# Altium schematic sheet BLOCK-DIAGRAM.SchDoc
size A4; SheetNumber: 2; SheetTotal: 7
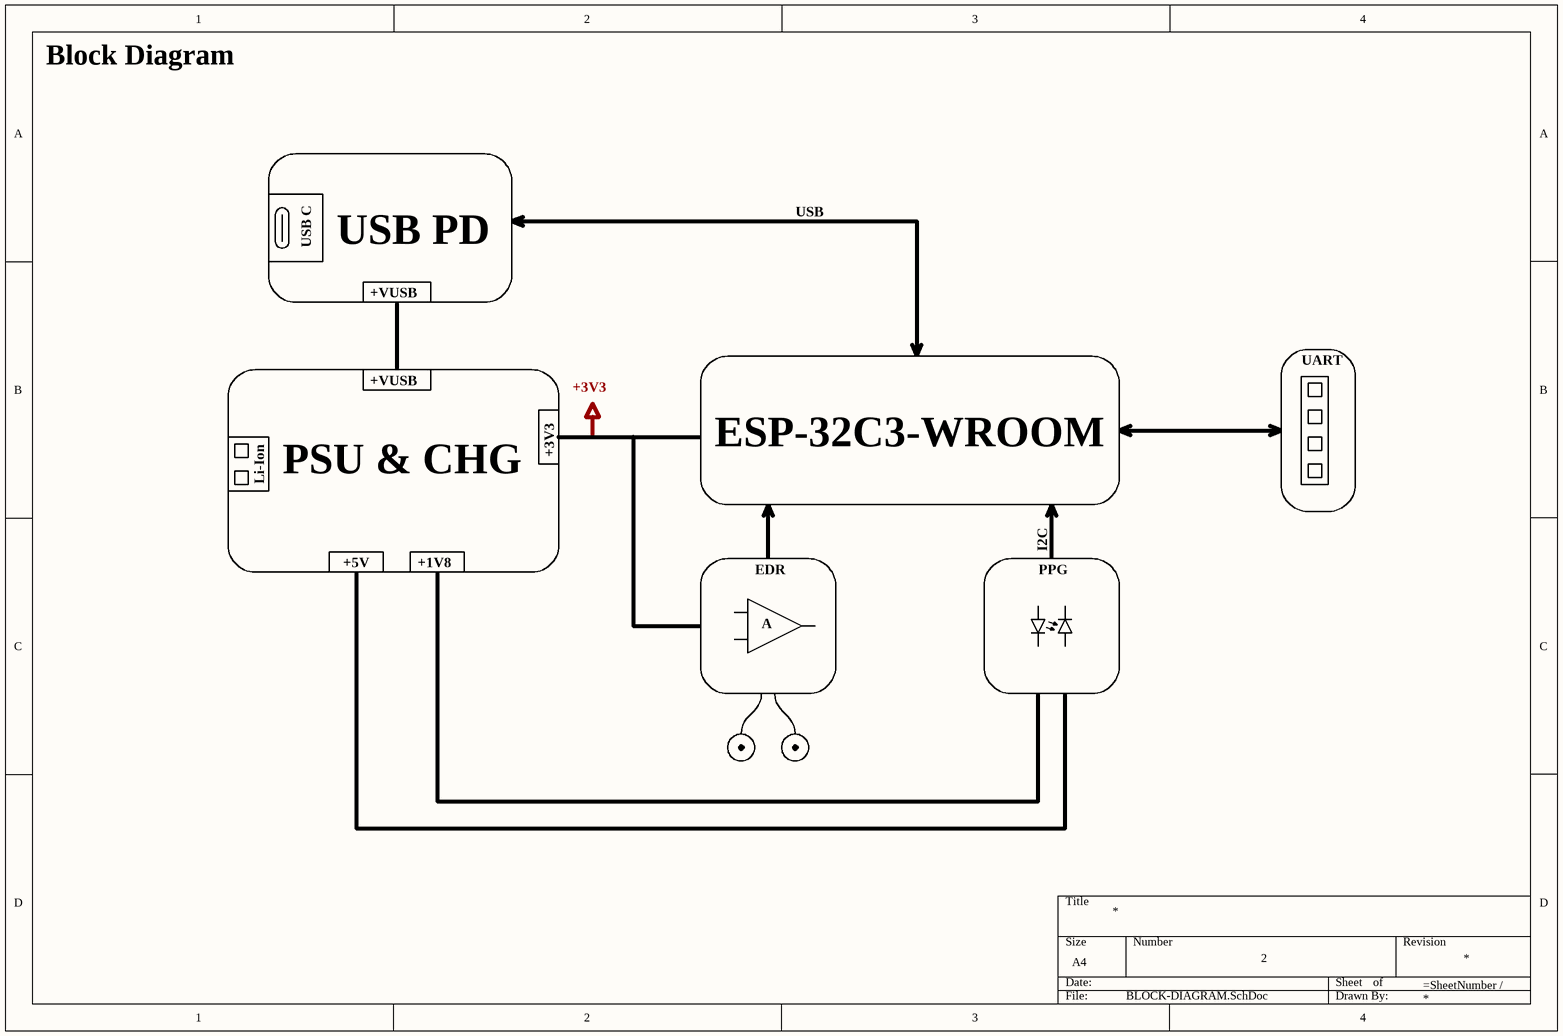
[diagram p0: BLOCK-DIAGRAM.SchDoc]

## Notes on the sheet
- Block Diagram
- USB C
- USB PD
- USB
- +VUSB
- UART
- +3V3
- Li-Ion
- PSU & CHG
- ESP-32C3-WROOM
- +5V
- +1V8
- EDR
- PPG
- I2C
- A